# Altium schematic sheet RK809_PMIC.SchDoc
size A2; SheetNumber: 7; SheetTotal: 8
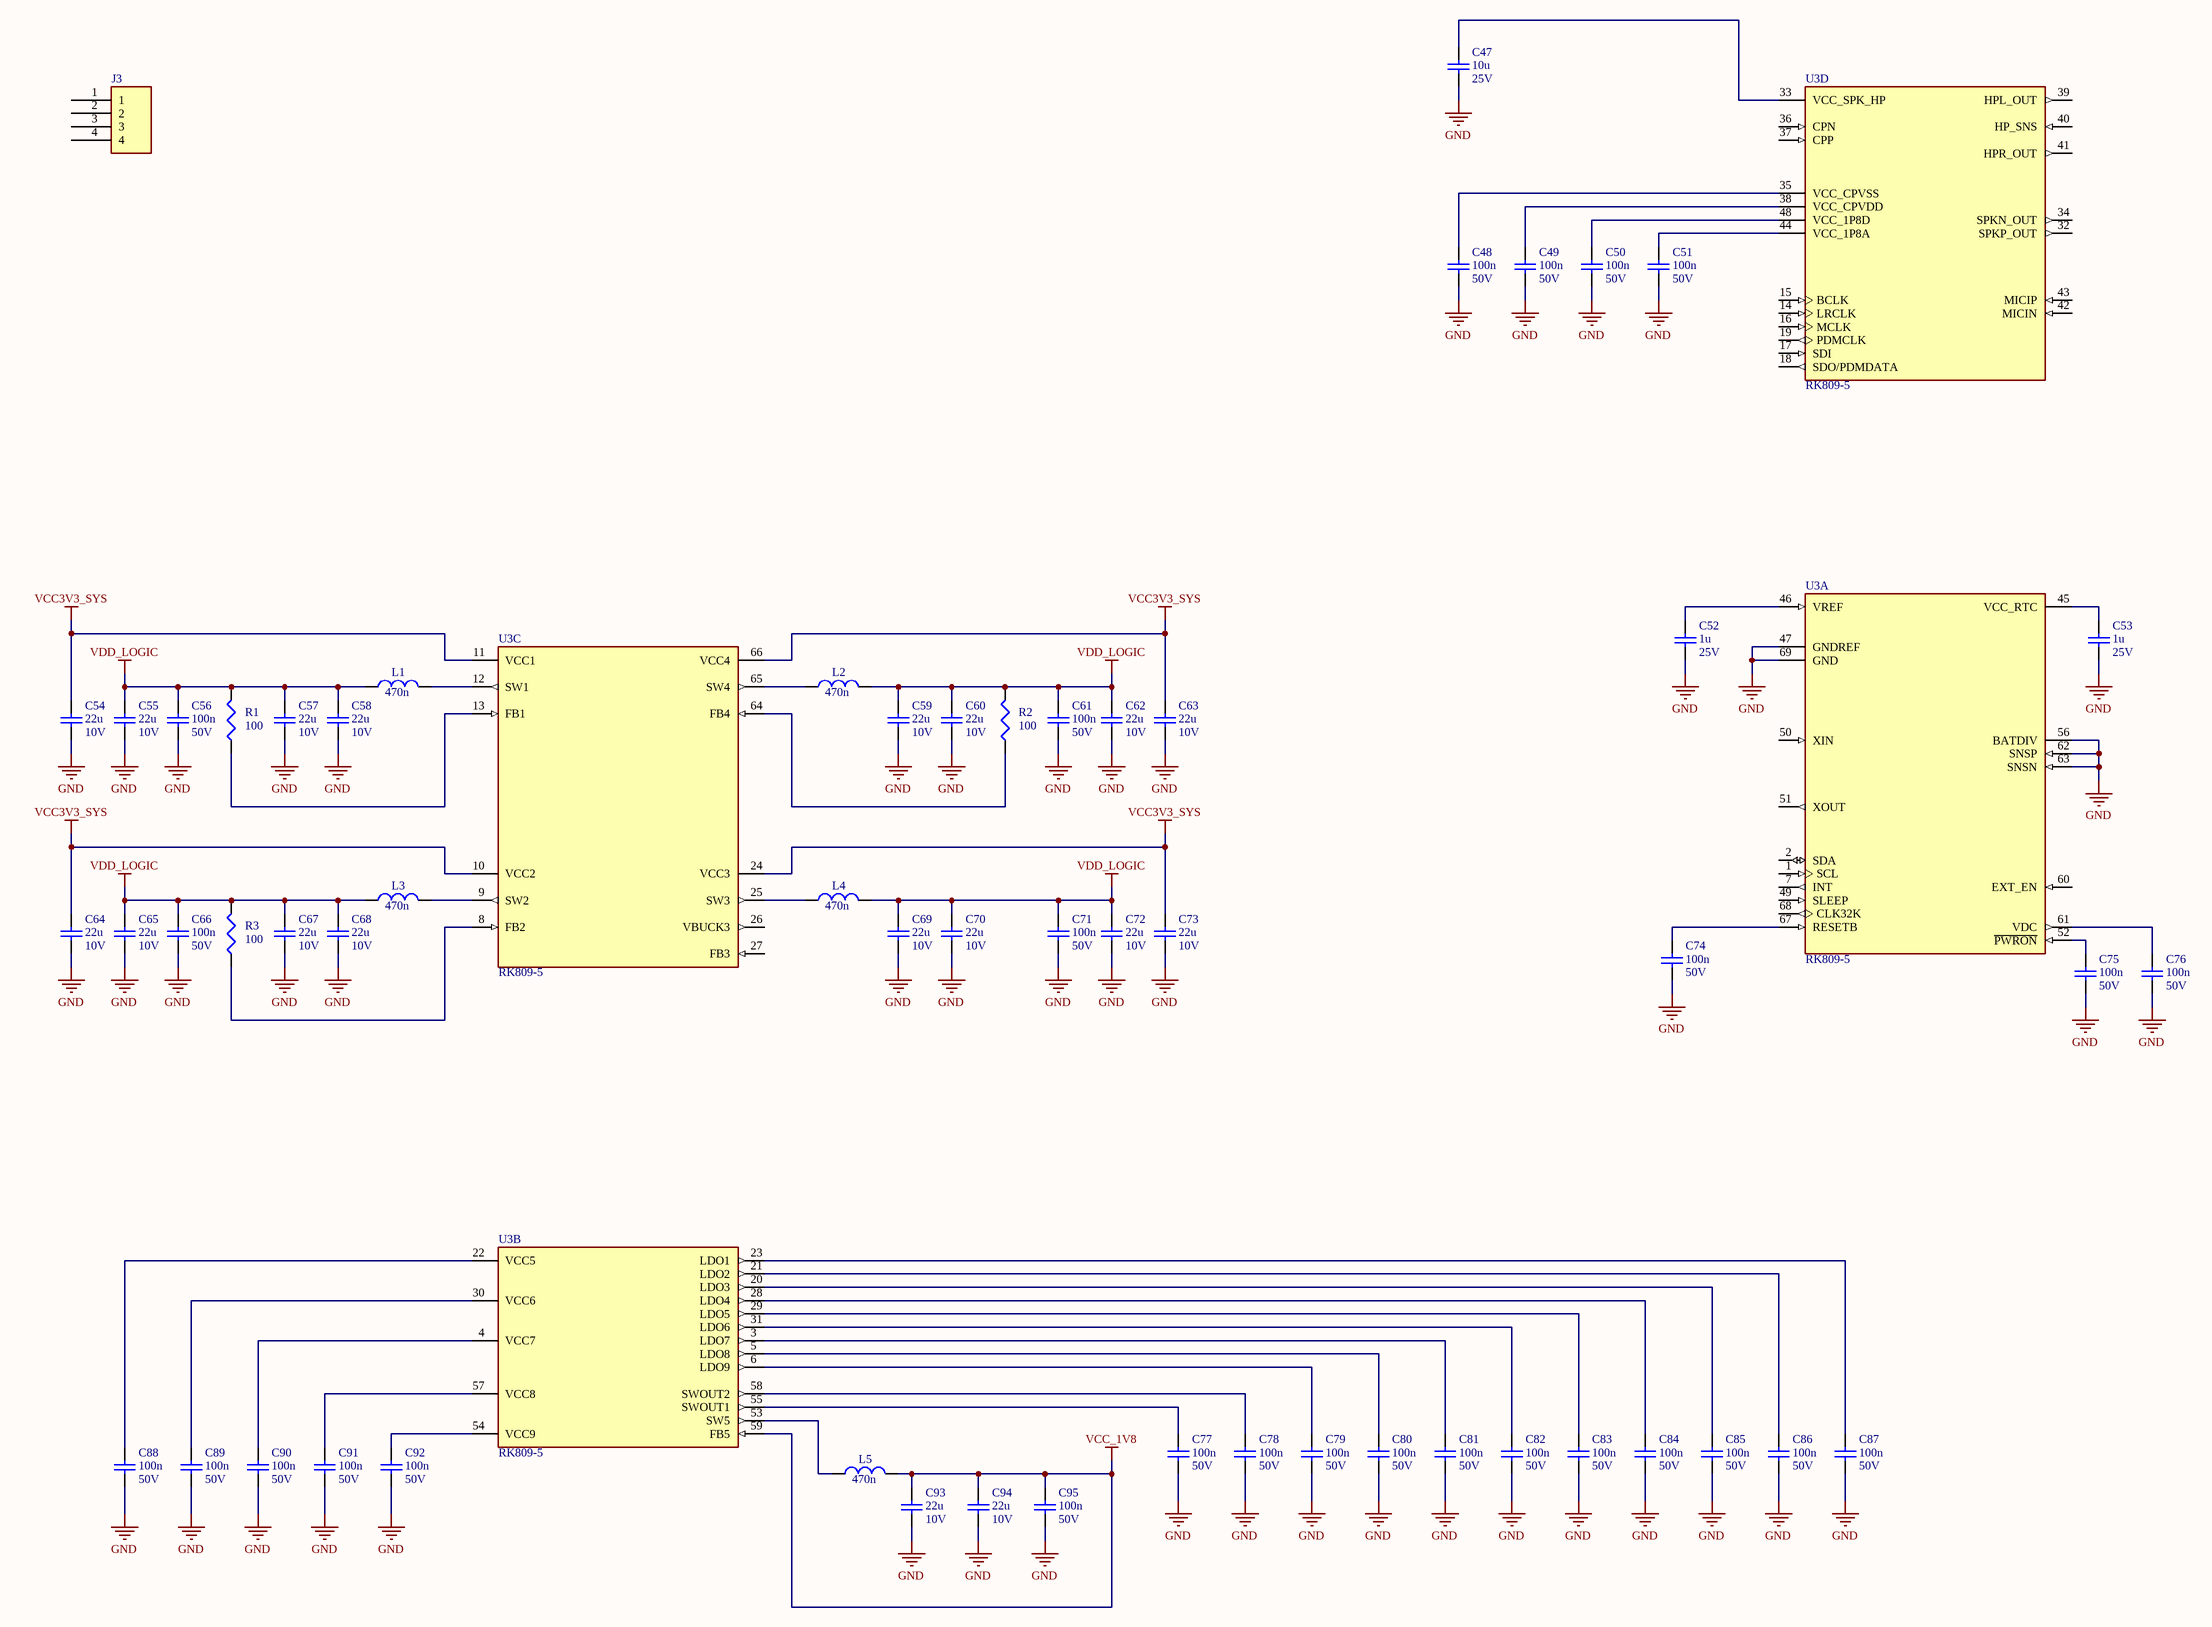
[diagram p0: RK809_PMIC.SchDoc]

## Parts
(Parts that share a designator on the sheet are numbered #1, #2 ... from top to bottom, then left to right.)
C47  value 10u  Voltage: 25V  (hidden comment: GRM188R61E106MA73D)
C48  value 100n  Voltage: 50V  (hidden comment: GRM155R71H104KE14D)
C49  value 100n  Voltage: 50V  (hidden comment: GRM155R71H104KE14D)
C50  value 100n  Voltage: 50V  (hidden comment: GRM155R71H104KE14D)
C51  value 100n  Voltage: 50V  (hidden comment: GRM155R71H104KE14D)
C52  value 1u  Voltage: 25V  (hidden comment: GRM155R61E105KA12D)
C53  value 1u  Voltage: 25V  (hidden comment: GRM155R61E105KA12D)
C54  value 22u  Voltage: 10V  (hidden comment: GRM188R61A226ME15D)
C55  value 22u  Voltage: 10V  (hidden comment: GRM188R61A226ME15D)
C56  value 100n  Voltage: 50V  (hidden comment: GRM155R71H104KE14D)
C57  value 22u  Voltage: 10V  (hidden comment: GRM188R61A226ME15D)
C58  value 22u  Voltage: 10V  (hidden comment: GRM188R61A226ME15D)
C59  value 22u  Voltage: 10V  (hidden comment: GRM188R61A226ME15D)
C60  value 22u  Voltage: 10V  (hidden comment: GRM188R61A226ME15D)
C61  value 100n  Voltage: 50V  (hidden comment: GRM155R71H104KE14D)
C62  value 22u  Voltage: 10V  (hidden comment: GRM188R61A226ME15D)
C63  value 22u  Voltage: 10V  (hidden comment: GRM188R61A226ME15D)
C64  value 22u  Voltage: 10V  (hidden comment: GRM188R61A226ME15D)
C65  value 22u  Voltage: 10V  (hidden comment: GRM188R61A226ME15D)
C66  value 100n  Voltage: 50V  (hidden comment: GRM155R71H104KE14D)
C67  value 22u  Voltage: 10V  (hidden comment: GRM188R61A226ME15D)
C68  value 22u  Voltage: 10V  (hidden comment: GRM188R61A226ME15D)
C69  value 22u  Voltage: 10V  (hidden comment: GRM188R61A226ME15D)
C70  value 22u  Voltage: 10V  (hidden comment: GRM188R61A226ME15D)
C71  value 100n  Voltage: 50V  (hidden comment: GRM155R71H104KE14D)
C72  value 22u  Voltage: 10V  (hidden comment: GRM188R61A226ME15D)
C73  value 22u  Voltage: 10V  (hidden comment: GRM188R61A226ME15D)
C74  value 100n  Voltage: 50V  (hidden comment: GRM155R71H104KE14D)
C75  value 100n  Voltage: 50V  (hidden comment: GRM155R71H104KE14D)
C76  value 100n  Voltage: 50V  (hidden comment: GRM155R71H104KE14D)
C77  value 100n  Voltage: 50V  (hidden comment: GRM155R71H104KE14D)
C78  value 100n  Voltage: 50V  (hidden comment: GRM155R71H104KE14D)
C79  value 100n  Voltage: 50V  (hidden comment: GRM155R71H104KE14D)
C80  value 100n  Voltage: 50V  (hidden comment: GRM155R71H104KE14D)
C81  value 100n  Voltage: 50V  (hidden comment: GRM155R71H104KE14D)
C82  value 100n  Voltage: 50V  (hidden comment: GRM155R71H104KE14D)
C83  value 100n  Voltage: 50V  (hidden comment: GRM155R71H104KE14D)
C84  value 100n  Voltage: 50V  (hidden comment: GRM155R71H104KE14D)
C85  value 100n  Voltage: 50V  (hidden comment: GRM155R71H104KE14D)
C86  value 100n  Voltage: 50V  (hidden comment: GRM155R71H104KE14D)
C87  value 100n  Voltage: 50V  (hidden comment: GRM155R71H104KE14D)
C88  value 100n  Voltage: 50V  (hidden comment: GRM155R71H104KE14D)
C89  value 100n  Voltage: 50V  (hidden comment: GRM155R71H104KE14D)
C90  value 100n  Voltage: 50V  (hidden comment: GRM155R71H104KE14D)
C91  value 100n  Voltage: 50V  (hidden comment: GRM155R71H104KE14D)
C92  value 100n  Voltage: 50V  (hidden comment: GRM155R71H104KE14D)
C93  value 22u  Voltage: 10V  (hidden comment: GRM188R61A226ME15D)
C94  value 22u  Voltage: 10V  (hidden comment: GRM188R61A226ME15D)
C95  value 100n  Voltage: 50V  (hidden comment: GRM155R71H104KE14D)
J3  SM04B-SRSS-TB  [SM04B-SRSS-TB]  (value not drawn)
L1  value 470n  (hidden comment: MCS20FC-R47MHC)
L2  value 470n  (hidden comment: MCS20FC-R47MHC)
L3  value 470n  (hidden comment: MCS20FC-R47MHC)
L4  value 470n  (hidden comment: MCS20FC-R47MHC)
L5  value 470n  (hidden comment: MCS20FC-R47MHC)
R1  value 100  (hidden comment: RC0402FR-07100RL)
R2  value 100  (hidden comment: RC0402FR-07100RL)
R3  value 100  (hidden comment: RC0402FR-07100RL)
U3#1  RK809-5  [QFN35P700X700X80-69N]  (parts A,D of 4)
U3#2  RK809-5  [QFN35P700X700X80-69N]  (parts B,C of 3)

## Nets
GND: C47.2 C48.2 C49.2 C50.2 C51.2 C52.2 C53.2 C54.2 C55.2 C56.2 C57.2 C58.2 C59.2 C60.2 C61.2 C62.2 C63.2 C64.2 C65.2 C66.2 C67.2 C68.2 C69.2 C70.2 C71.2 C72.2 C73.2 C74.2 C75.2 C76.2 C77.2 C78.2 C79.2 C80.2 C81.2 C82.2 C83.2 C84.2 C85.2 C86.2 C87.2 C88.2 C89.2 C90.2 C91.2 C92.2 C93.2 C94.2 C95.2 U3#1.47(GNDREF) U3#1.56(BATDIV) U3#1.62(SNSP) U3#1.63(SNSN) U3#1.69(GND)
VCC3V3_SYS: C54.1 C63.1 C64.1 C73.1 U3#2.10(VCC2) U3#2.11(VCC1) U3#2.24(VCC3) U3#2.66(VCC4)
VCC_1V8: C93.1 C94.1 C95.1 L5.2 U3#2.59(FB5)
VDD_LOGIC: C55.1 C56.1 C57.1 C58.1 C59.1 C60.1 C61.1 C62.1 C65.1 C66.1 C67.1 C68.1 C69.1 C70.1 C71.1 C72.1 L1.1 L2.2 L3.1 L4.2 R1.1 R2.1 R3.1
NetC47_1: C47.1 U3#1.33(VCC_SPK_HP)
NetC48_1: C48.1 U3#1.35(VCC_CPVSS)
NetC49_1: C49.1 U3#1.38(VCC_CPVDD)
NetC50_1: C50.1 U3#1.48(VCC_1P8D)
NetC51_1: C51.1 U3#1.44(VCC_1P8A)
NetC52_1: C52.1 U3#1.46(VREF)
NetC53_1: C53.1 U3#1.45(VCC_RTC)
NetC74_1: C74.1 U3#1.67(RESETB)
NetC75_1: C75.1 U3#1.52(~{PWRON})
NetC76_1: C76.1 U3#1.61(VDC)
NetC77_1: C77.1 U3#2.55(SWOUT1)
NetC78_1: C78.1 U3#2.58(SWOUT2)
NetC79_1: C79.1 U3#2.6(LDO9)
NetC80_1: C80.1 U3#2.5(LDO8)
NetC81_1: C81.1 U3#2.3(LDO7)
NetC82_1: C82.1 U3#2.31(LDO6)
NetC83_1: C83.1 U3#2.29(LDO5)
NetC84_1: C84.1 U3#2.28(LDO4)
NetC85_1: C85.1 U3#2.20(LDO3)
NetC86_1: C86.1 U3#2.21(LDO2)
NetC87_1: C87.1 U3#2.23(LDO1)
NetC88_1: C88.1 U3#2.22(VCC5)
NetC89_1: C89.1 U3#2.30(VCC6)
NetC90_1: C90.1 U3#2.4(VCC7)
NetC91_1: C91.1 U3#2.57(VCC8)
NetC92_1: C92.1 U3#2.54(VCC9)
NetL1_2: L1.2 U3#2.12(SW1)
NetL2_1: L2.1 U3#2.65(SW4)
NetL3_2: L3.2 U3#2.9(SW2)
NetL4_1: L4.1 U3#2.25(SW3)
NetL5_1: L5.1 U3#2.53(SW5)
NetR1_2: R1.2 U3#2.13(FB1)
NetR2_2: R2.2 U3#2.64(FB4)
NetR3_2: R3.2 U3#2.8(FB2)

Not connected (* = marked no-connect by the designer): J3 1 2 3 4; U3#1 1(SCL) 2(SDA) 7(INT) 14(LRCLK) 15(BCLK) 16(MCLK) 17(SDI) 18(SDO/PDMDATA) 19(PDMCLK) 32(SPKP_OUT) 34(SPKN_OUT) 36(CPN) 37(CPP) 39(HPL_OUT) 40(HP_SNS) 41(HPR_OUT) 42(MICIN) 43(MICIP) 49(SLEEP) 50(XIN) 51(XOUT) 60(EXT_EN) 68(CLK32K); U3#2 26(VBUCK3) 27(FB3)

## Library data of the parts
C47 = GRM188R61E106MA73D: CAP 10U 25V X5R 0603; Size: 0603; Dielectric: X5R
C48-C51 C56 C61 C66 C71 C74-C92 C95 = GRM155R71H104KE14D: CAP 100N 50V X7R 0402; Size: 0402; Dielectric: X7R
C52 C53 = GRM155R61E105KA12D: CAP 1U 25V X5R 0402; Size: 0402; Dielectric: X5R
C54 C55 C57-C60 C62-C65 C67-C70 C72 C73 C93 C94 = GRM188R61A226ME15D: CAP 22U 10V X5R 0603; Dielectric: 5; Size: 0603
J3 = SM04B-SRSS-TB: JST-SH 4P; Manufacturer Part Number 1: SM04B-SRSS-TB
L1-L5 = MCS20FC-R47MHC: IND 470N 4.05A 0806
R1-R3 = RC0402FR-07100RL: RES 100 1% 0402; Size: 0603
U3#1 U3#2 = RK809-5: Complex power-management integrated circuit (PMIC) integratedCODEC for multi-core system applications; MF: Fuzhou Rockchip Electronics Co; MP: RK809-1; SnapEDA_Link: https://www.snapeda.com/parts/RK809-1/Fuzhou+Rockchip+Electronics+Co/view-part/?ref=snap; Package: Package; Value: *; Check_prices: https://www.snapeda.com/parts/RK809-1/Fuzhou+Rockchip+Electronics+Co/view-part/?ref=eda